# Altium project EPS_board.PrjPcb
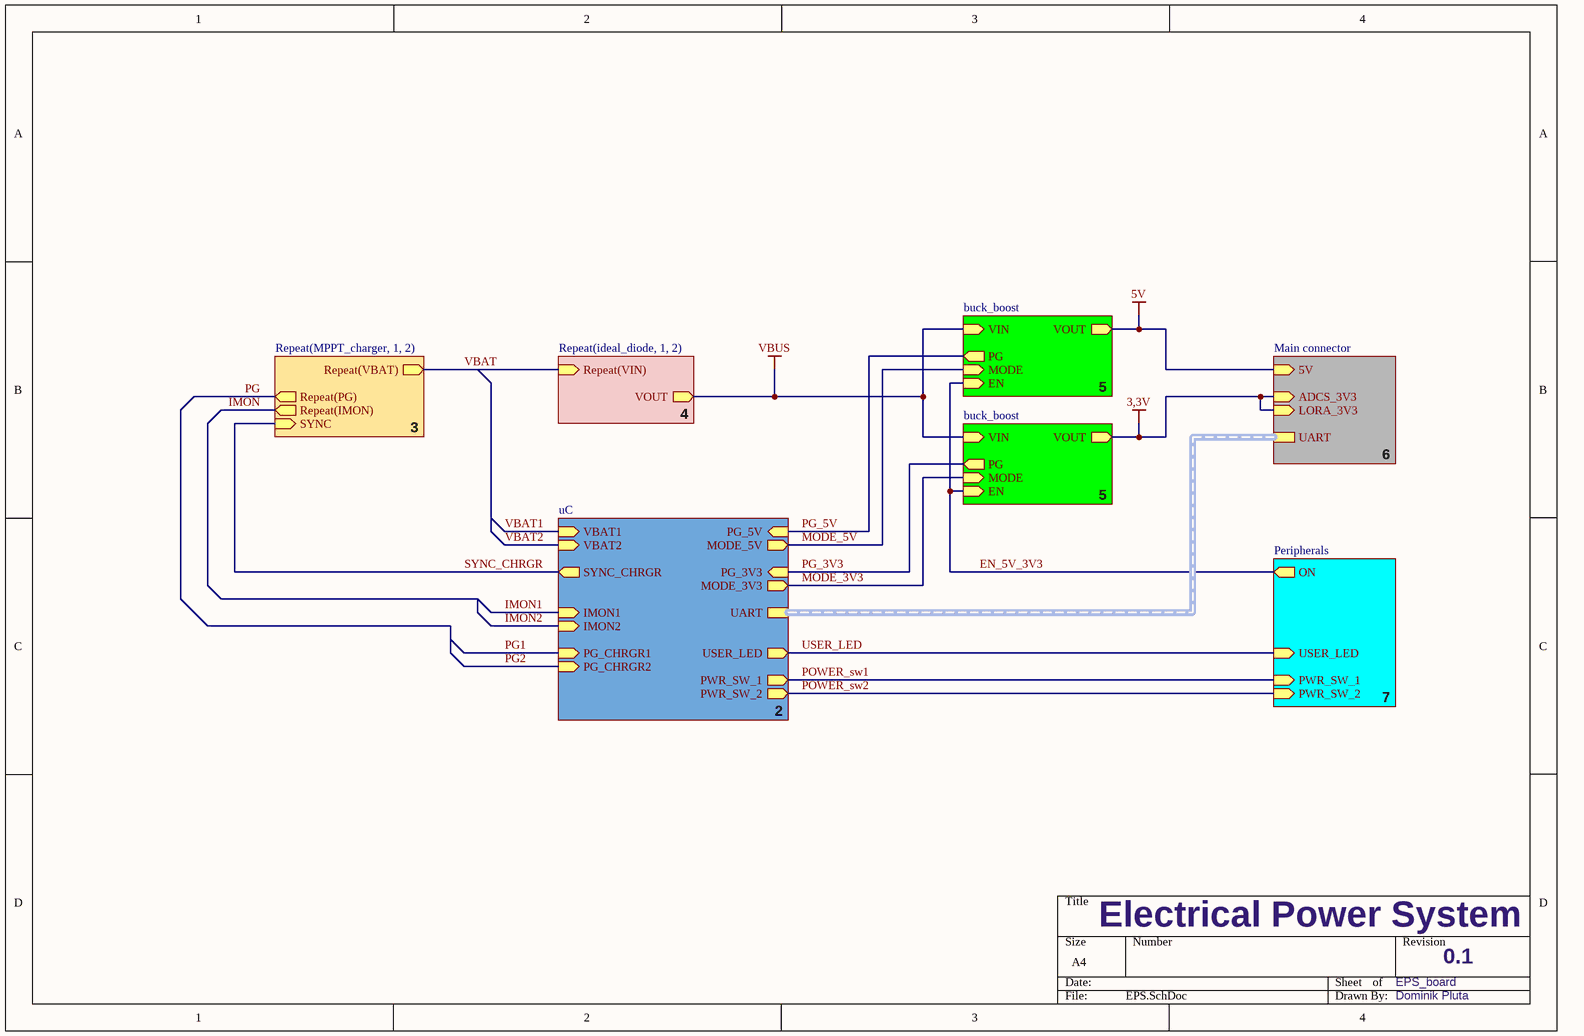
[diagram p0: EPS.SchDoc]
7 sheets, 124 parts. Net scope: hierarchical (ports join the sheet entries above them; power ports are global).
Board file: EPS.PcbDoc
Sheets:
  EPS.SchDoc
    uC = uC.SchDoc
    MPPT_charger1 = MPPT_charger.SchDoc
    MPPT_charger2 = MPPT_charger.SchDoc
    buck_boost = buck_boost.SchDoc
    buck_boost = buck_boost.SchDoc
    ideal_diode1 = ideal_diode.SchDoc
    ideal_diode2 = ideal_diode.SchDoc
    Main connector = main_connector.SchDoc
    Peripherals = peripherals.SchDoc

## Sheet EPS.SchDoc
size A4; SheetNumber: 1; SheetTotal: 7

### Sub-sheets
buck_boost = buck_boost.SchDoc: VIN (in), EN (in), MODE (in), VOUT (out), PG (out)
buck_boost = buck_boost.SchDoc: VIN (in), EN (in), MODE (in), VOUT (out), PG (out)
Main connector = main_connector.SchDoc: 5V (in), ADCS_3V3 (in), LORA_3V3 (in), UART (harness UART)
Peripherals = peripherals.SchDoc: ON (out), PWR_SW_1 (in), PWR_SW_2 (in), USER_LED (in)
Repeat(ideal_diode, 1, 2) = ideal_diode.SchDoc: VOUT (out), Repeat(VIN) (in)
Repeat(MPPT_charger, 1, 2) = MPPT_charger.SchDoc: Repeat(PG) (out), Repeat(IMON) (out), Repeat(VBAT) (out), SYNC (in)
uC = uC.SchDoc: VBAT1 (in), VBAT2 (in), USER_LED (out), MODE_5V (out), PG_5V (in), MODE_3V3 (out), PG_3V3 (in), IMON1 (in), PG_CHRGR1 (in), SYNC_CHRGR (out), IMON2 (in), PG_CHRGR2 (in), UART (harness UART), PWR_SW_1 (out), PWR_SW_2 (out)

### Nets
3,3V: sheet buck_boost/VOUT, sheet Main connector/ADCS_3V3, sheet Main connector/LORA_3V3
5V: sheet buck_boost/VOUT, sheet Main connector/5V
VBUS: sheet buck_boost/VIN, sheet buck_boost/VIN, sheet Repeat(ideal_diode, 1, 2)/VOUT
EN_5V_3V3: sheet buck_boost/EN, sheet buck_boost/EN, sheet Peripherals/ON
IMON: sheet Repeat(MPPT_charger, 1, 2)/Repeat(IMON)
MODE_3V3: sheet uC/MODE_3V3, sheet buck_boost/MODE
MODE_5V: sheet uC/MODE_5V, sheet buck_boost/MODE
PG: sheet Repeat(MPPT_charger, 1, 2)/Repeat(PG)
PG_3V3: sheet uC/PG_3V3, sheet buck_boost/PG
PG_5V: sheet uC/PG_5V, sheet buck_boost/PG
POWER_sw1: sheet uC/PWR_SW_1, sheet Peripherals/PWR_SW_1
POWER_sw2: sheet uC/PWR_SW_2, sheet Peripherals/PWR_SW_2
SYNC_CHRGR: sheet uC/SYNC_CHRGR, sheet Repeat(MPPT_charger, 1, 2)/SYNC
USER_LED: sheet uC/USER_LED, sheet Peripherals/USER_LED
VBAT: sheet Repeat(MPPT_charger, 1, 2)/Repeat(VBAT), sheet Repeat(ideal_diode, 1, 2)/Repeat(VIN)

### Buses and harness runs
harness sheet Main connector/UART = sheet uC/UART

### Notes on the sheet
- 3
- 4
- 5
- 6
- 2
- 7
- Electrical Power System
- EPS_board
- 0.1
- Dominik Pluta

## Sheet uC.SchDoc
size A3; SheetNumber: 2; SheetTotal: 7
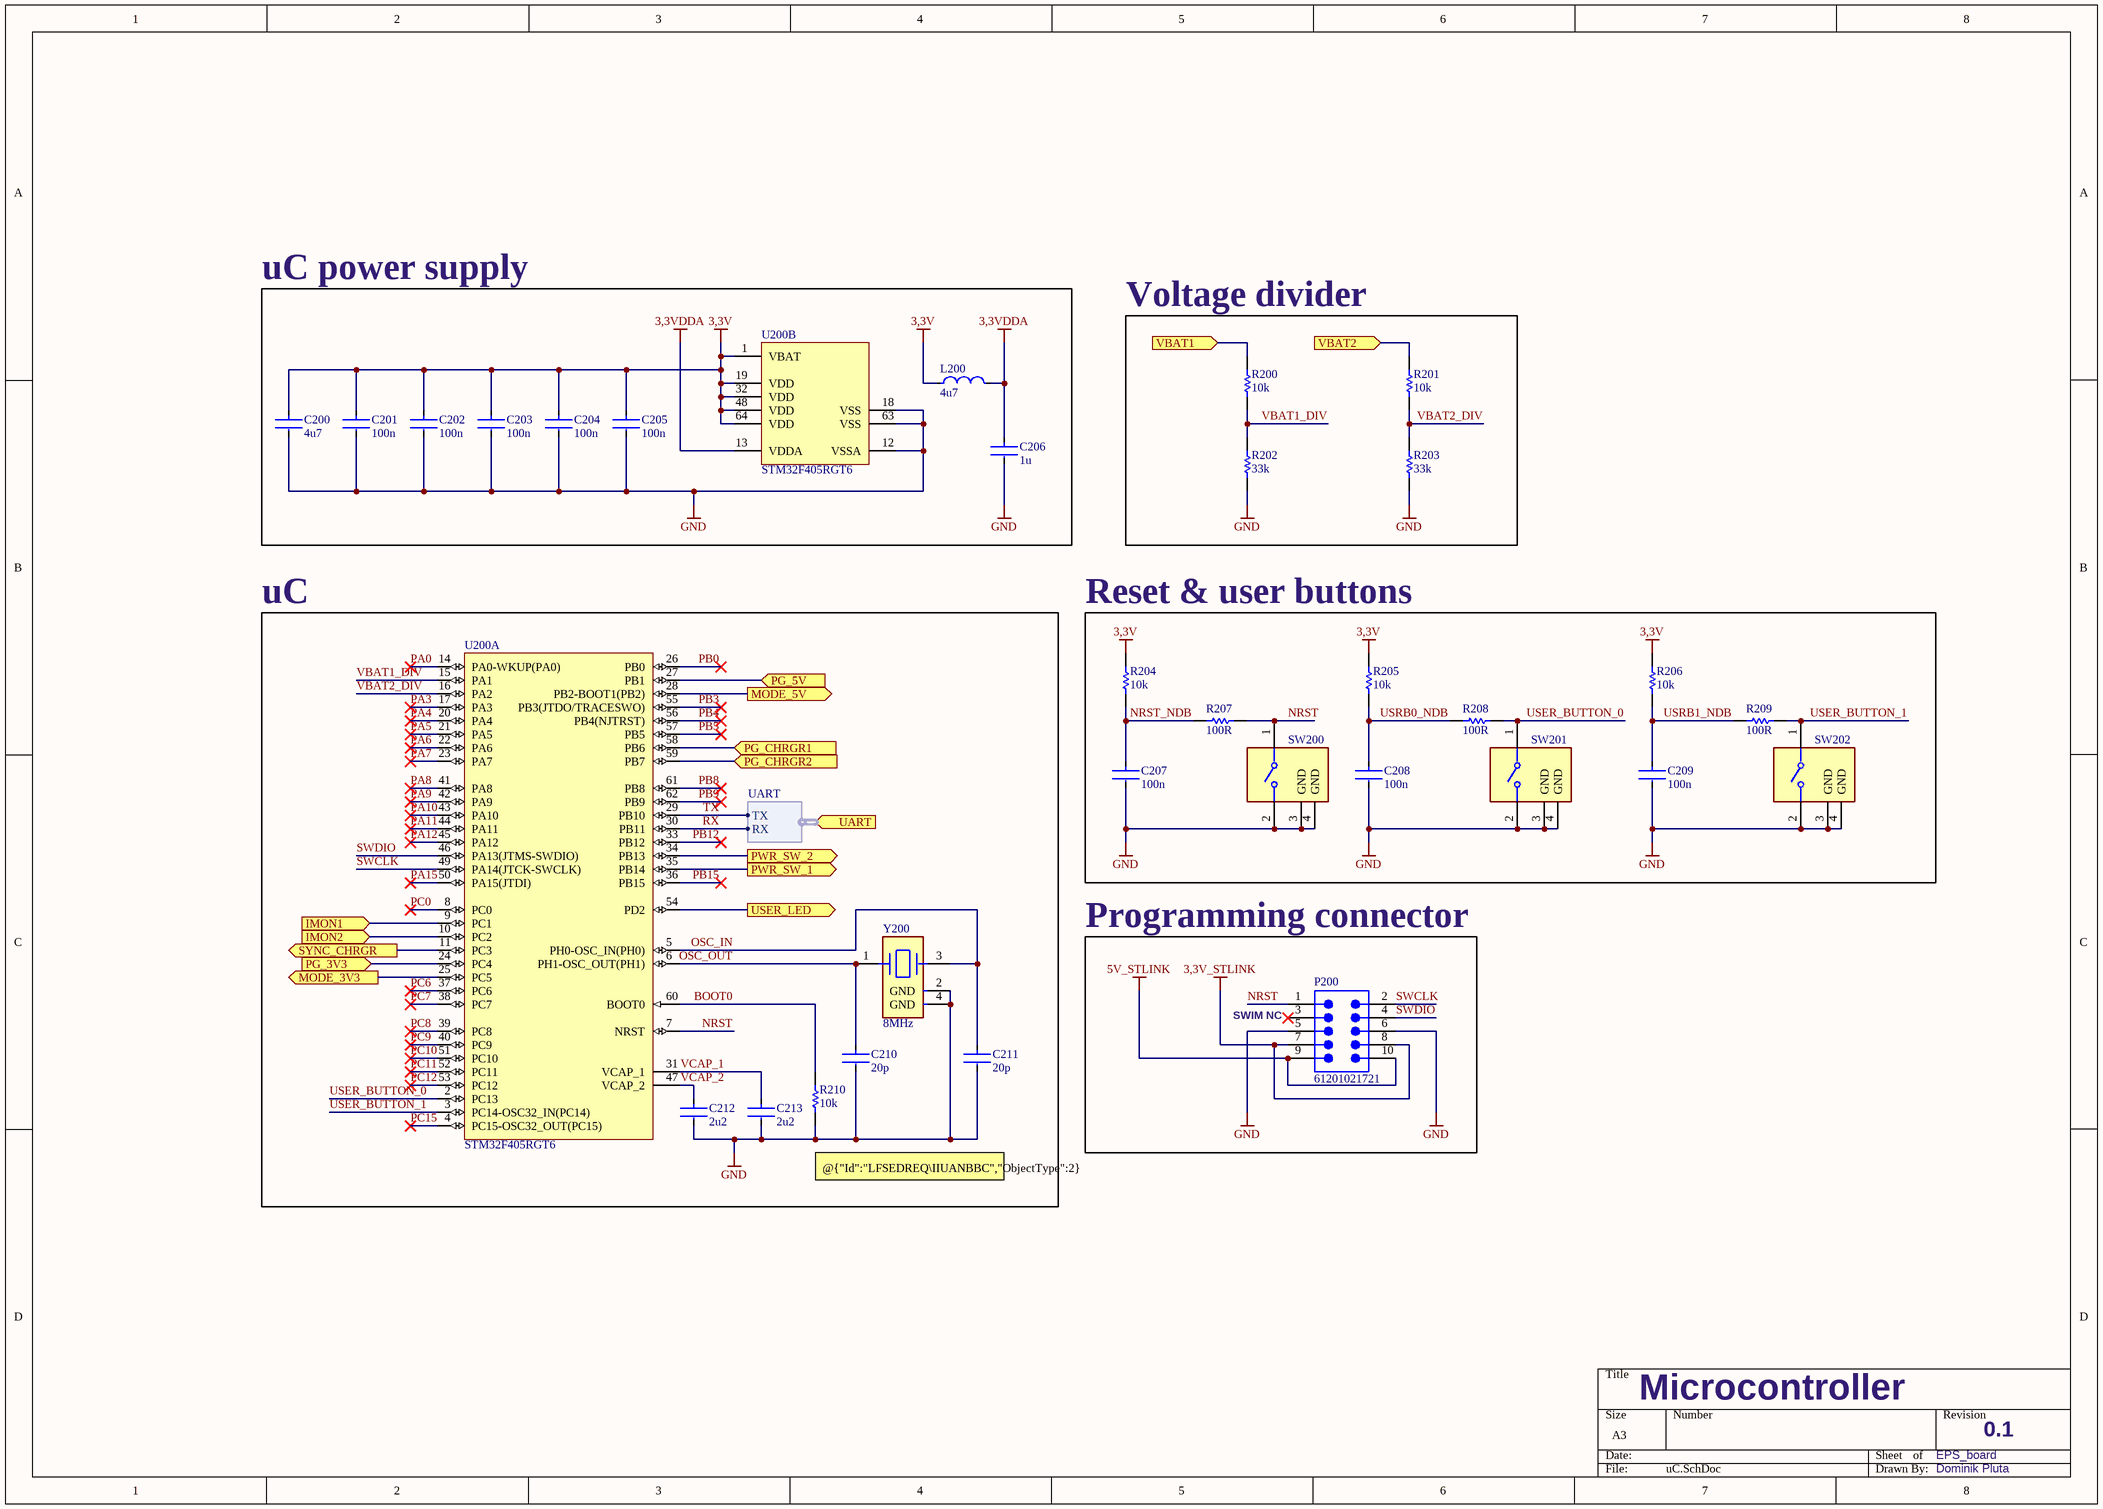
[diagram p1: uC.SchDoc]

### Parts
C200  4u7  [FP-C0603C-CF-MFG]
C201  100n  [FP-C0603C-CF-MFG]
C202  100n  [FP-C0603C-CF-MFG]
C203  100n  [FP-C0603C-CF-MFG]
C204  100n  [FP-C0603C-CF-MFG]
C205  100n  [FP-C0603C-CF-MFG]
C206  1u  [FP-C0603C-CF-MFG]
C207  100n  [FP-C0603C-CF-MFG]
C208  100n  [FP-C0603C-CF-MFG]
C209  100n  [FP-C0603C-CF-MFG]
C210  20p  [FP-C0603C-CF-MFG]
C211  20p  [FP-C0603C-CF-MFG]
C212  2u2  [FP-C0603C-CF-MFG]
C213  2u2  [FP-C0603C-CF-MFG]
L200  4u7  [FP-LQM21DN_00-MFG]
P200  61201021721  [61201021721]
R200  10k  [RESC0603(1608)_N]
R201  10k  [RESC0603(1608)_N]
R202  33k  [RESC0603(1608)_N]
R203  33k  [RESC0603(1608)_N]
R204  10k  [RESC0603(1608)_N]
R205  10k  [RESC0603(1608)_N]
R206  10k  [RESC0603(1608)_N]
R207  100R  [RESC0603(1608)_N]
R208  100R  [RESC0603(1608)_N]
R209  100R  [RESC0603(1608)_N]
R210  10k  [RESC0603(1608)_N]
SW200  B3F-3122  [FP-B3F-3122-MFG]  (value not drawn)
SW201  B3F-3122  [FP-B3F-3122-MFG]  (value not drawn)
SW202  B3F-3122  [FP-B3F-3122-MFG]  (value not drawn)
U200  STM32F405RGT6  [STM-LQFP64_M]  (parts A,B of 2)
Y200  8MHz  [FP-7M-MFG]

### Blocks framed on the sheet
uC power supply: C200-C206 L200 U200
Voltage divider: R200-R203
uC: C210-C213 R210 U200 Y200
Reset & user buttons: C207-C209 R204-R209 SW200-SW202
Programming connector: P200

### Ports
IMON1 (in, see EPS[2C]), IMON2 (in, see EPS[2C]), MODE_3V3 (out, see EPS[3C]), MODE_5V (out, see EPS[3C]), PG_3V3 (in, see EPS[3C]), PG_5V (in, see EPS[3C]), PG_CHRGR1 (in, see EPS[2C]), PG_CHRGR2 (in, see EPS[2C]), PWR_SW_1 (out, see EPS[3C], peripherals[2B]), PWR_SW_2 (out, see EPS[3C], peripherals[2C]), SYNC_CHRGR (out, see EPS[2C]), UART (in, harness UART, see EPS[3C], main_connector[1C]), USER_LED (out, see EPS[3C], peripherals[1B]), VBAT1 (in, see EPS[2C]), VBAT2 (in, see EPS[2C])

### Harnesses
UART: RX, TX

### Nets
3,3V: C200.1 C201.1 C202.1 C203.1 C204.1 C205.1 L200.1 R204.2 R205.2 R206.2 U200.1(VBAT) U200.19(VDD) U200.32(VDD) U200.48(VDD) U200.64(VDD)
3,3V_STLINK: P200.7 P200.8
3,3VDDA: C206.1 L200.2 U200.13(VDDA)
5V_STLINK: P200.9 P200.10
GND: C200.2 C201.2 C202.2 C203.2 C204.2 C205.2 C206.2 C207.2 C208.2 C209.2 C210.2 C211.2 C212.2 C213.2 P200.5 P200.6 R202.1 R203.1 R210.1 SW200.2 SW200.3(GND) SW200.4(GND) SW201.2 SW201.3(GND) SW201.4(GND) SW202.2 SW202.3(GND) SW202.4(GND) U200.12(VSSA) U200.18(VSS) U200.63(VSS) Y200.2(GND) Y200.4(GND)
BOOT0: R210.2 U200.60(BOOT0)
IMON1: U200.9(PC1) ; port IMON1
IMON2: U200.10(PC2) ; port IMON2
MODE_3V3: U200.25(PC5) ; port MODE_3V3
MODE_5V: U200.28(PB2-BOOT1(PB2)) ; port MODE_5V
NRST: P200.1 R207.1 SW200.1 U200.7(NRST)
NRST_NDB: C207.1 R204.1 R207.2
OSC_IN: C211.1 U200.5(PH0-OSC_IN(PH0)) Y200.3
OSC_OUT: C210.1 U200.6(PH1-OSC_OUT(PH1)) Y200.1
PA0: U200.14(PA0-WKUP(PA0))
PA3: U200.17(PA3)
PA4: U200.20(PA4)
PA5: U200.21(PA5)
PA6: U200.22(PA6)
PA7: U200.23(PA7)
PA8: U200.41(PA8)
PA9: U200.42(PA9)
PA10: U200.43(PA10)
PA11: U200.44(PA11)
PA12: U200.45(PA12)
PA15: U200.50(PA15(JTDI))
PB0: U200.26(PB0)
PB3: U200.55(PB3(JTDO/TRACESWO))
PB4: U200.56(PB4(NJTRST))
PB5: U200.57(PB5)
PB8: U200.61(PB8)
PB9: U200.62(PB9)
PB12: U200.33(PB12)
PB15: U200.36(PB15)
PC0: U200.8(PC0)
PC6: U200.37(PC6)
PC7: U200.38(PC7)
PC8: U200.39(PC8)
PC9: U200.40(PC9)
PC10: U200.51(PC10)
PC11: U200.52(PC11)
PC12: U200.53(PC12)
PC15: U200.4(PC15-OSC32_OUT(PC15))
PG: U200.58(PB6) ; port PG_CHRGR1
PG: U200.59(PB7) ; port PG_CHRGR2  [a separate net that carries the same name]
PG_3V3: U200.24(PC4) ; port PG_3V3
PG_5V: U200.27(PB1) ; port PG_5V
POWER_sw1: U200.35(PB14) ; port PWR_SW_1
POWER_sw2: U200.34(PB13) ; port PWR_SW_2
RX: U200.30(PB11) ; port UART.RX
SWCLK: P200.2 U200.49(PA14(JTCK-SWCLK))
SWDIO: P200.4 U200.46(PA13(JTMS-SWDIO))
SYNC_CHRGR: U200.11(PC3) ; port SYNC_CHRGR
TX: U200.29(PB10) ; port UART.TX
USER_BUTTON_0: R208.1 SW201.1 U200.2(PC13)
USER_BUTTON_1: R209.1 SW202.1 U200.3(PC14-OSC32_IN(PC14))
USER_LED: U200.54(PD2) ; port USER_LED
USRB0_NDB: C208.1 R205.1 R208.2
USRB1_NDB: C209.1 R206.1 R209.2
VBAT1: R200.2 ; port VBAT1
VBAT1_DIV: R200.1 R202.2 U200.15(PA1)
VBAT2: R201.2 ; port VBAT2
VBAT2_DIV: R201.1 R203.2 U200.16(PA2)
VCAP_1: C213.1 U200.31(VCAP_1)
VCAP_2: C212.1 U200.47(VCAP_2)

Not connected (* = marked no-connect by the designer): P200 3*

### Notes on the sheet
- (near P200) SWIM NC
- @{"Id":"LFSEDREQ\IIUANBBC","ObjectType":2} = @{"Id":"LFSEDREQ\BUITQFAR","ObjectType":2} = (CL - 4pF) * 2
- Microcontroller
- EPS_board
- 0.1
- Dominik Pluta

### Library data of the parts
C200 C206 = CMP-2006-03061-2: CAP CER 0.1UF 50V X7R 0603; Manufacturer: KEMET; Manufacturer Part Number: C0603C104K5RACTU; Tolerance: 0.1; Temperature Coefficient: 30ppm/°C; Material: Ceramic; Automotive Grade: Grade 1; Value: 0.10 μF; Temperature: -55°C to +125°C; RoHS: TRUE; Temperature Range High: +125°C; Lead Free: Yes; Octopart: https://octopart.com/c0603c104k5ractu-kemet-139244; Digikey Description: CAP CER 0.1UF 50V X7R 0603; Category: Cap; Package: C0603C-CF; ComponentLink2Description: Datasheet; Temperature Range Low: -55°C; Device Class L1: Passive Components; Voltage Rating: 50 V; Automotive: Yes; Device Class L3: Ceramic Capacitors; ComponentLink2URL: https://api.kemet.com/component-edge/download/datasheet/C0603C100J5GACAUTO.pdf; Capacitance: 0.10 μF; Device Class L2: Capacitors; Temperature Characteristic: X7R; Height: 0.87mm
C201-C205 = CMP-2006-03061-2: CAP 0.1 μF, X5R or X7R ceramic; Tolerance: 10; Capacitance: 0.10 μF; Material: Ceramic; Category: Cap; Package: 0603; ComponentLink2Description: Datasheet; Device Class L1: Passive Components; Device Class L3: Ceramic Capacitors; ComponentLink2URL: https://api.kemet.com/component-edge/download/datasheet/C0603C100J5GACAUTO.pdf; Device Class L2: Capacitors
C207-C209 = CMP-2006-03061-2: CAP 0.1 μF, ceramic; Tolerance: 10; Capacitance: 0.10 μF; Material: Ceramic; Category: Cap; Package: 0603; ComponentLink2Description: Datasheet; Device Class L1: Passive Components; Device Class L3: Ceramic Capacitors; ComponentLink2URL: https://api.kemet.com/component-edge/download/datasheet/C0603C100J5GACAUTO.pdf; Device Class L2: Capacitors
C210-C213 = CMP-2006-03061-2: CAP CER 50V X7R 0603; Manufacturer: KEMET; Manufacturer Part Number: C0603C104K5RACTU; Tolerance: 0.1; Temperature Coefficient: 30ppm/°C; Material: Ceramic; Automotive Grade: Grade 1; Value: 0.10 μF; Temperature: -55°C to +125°C; RoHS: TRUE; Temperature Range High: +125°C; Lead Free: Yes; Octopart: https://octopart.com/c0603c104k5ractu-kemet-139244; Digikey Description: CAP CER 0.1UF 50V X7R 0603; Category: Cap; Package: C0603C-CF; ComponentLink2Description: Datasheet; Temperature Range Low: -55°C; Device Class L1: Passive Components; Voltage Rating: 50 V; Automotive: Yes; Device Class L3: Ceramic Capacitors; ComponentLink2URL: https://api.kemet.com/component-edge/download/datasheet/C0603C100J5GACAUTO.pdf; Capacitance: 0.10 μF; Device Class L2: Capacitors; Temperature Characteristic: X7R; Height: 0.87mm
L200 = CMP-06042-016438-1: Multilayer Type Inductor for General Circuits, 0805 (2012), 0.22μH, 10%, 0.38Ω, 250mA; Shielding: Shielded; Self Resonant Frequency: 220MHz; Q Factor: 20; DC Resistance (DCR): 380mR; Inductance: 220nH; Core Material: Ferrite; Test Frequency: 25MHz; Min Operating Temperature: -40°C; RoHS Compliant: Yes; Inductance Tolerance: 10%; Width: 1.25mm; Current Rating: 250mA; Rated Current-Max: 250mA; Package Quantity: 4000; Lead Free: Lead Free; Termination: SMD/SMT; Military Standard: Not; Case Code (Metric): 2012; Radiation Hardening: No; Max Operating Temperature: 85°C; Max DC Current: 250mA; Mount: Surface Mount; Length: 2mm; Packaging: Tape and Reel; Height - Seated (Max): 0.041inch; Series: LQM21N; Case Code (Imperial): 0805; Case/Package: 0805; REACH SVHC: No SVHC; Depth: 1.45mm; Tolerance: 10%; DC Current: 250mA; Number of Pins: 2; Height: 0.85mm
P200 = CMP-1502-00021-2: NexarPartId: 8917787; Operating Supply Voltage: 250V; Number of Positions: 10; Contact Resistance: 20mΩ; Connector Type: Male Pin; Current Rating: 3A; Pitch: 2.54mm; Gender: Male; Insulation Resistance: 1GΩ; Insulation: Insulated; Max Operating Temperature: 105°C; Flammability Rating: UL94 V-0; Mount: Through Hole; Contact Material: Copper; Min Operating Temperature: -40°C; Length: 20.36mm; Number of Contacts: 10; Height: 8.85mm; Number of Rows: 2; Housing Material: PBT; Color: Black; Contact Gender: Male; Orientation: Right Angle; Contact Plating: Gold; Number of Pins: 10; Voltage Rating (DC): 250V; RoHS: Compliant; Insulation Material: PBT; REACH SVHC: Unknown; Row Spacing: 2.54mm; Voltage Rating: 250V; Width: 20.36mm; Lead Pitch: 2.54mm; Termination: Through Hole
R200 R204-R206 R210 = CMP-1012-00081-1: 10k 0.1W 5% 0603 SMD; Case-Metric: 1608; Value: 10000.00 Ohm; Case-EIA: 0603; Tolerance: 5 %; Technology: SMT; Power: 0.1 W
R201 = CMP-1012-00081-1: 10k 0.1W 5% 0603  SMD; Case-Metric: 1608; Value: 10000.00 Ohm; Case-EIA: 0603; Tolerance: 5 %; Technology: SMT; Power: 0.1 W
R202 R203 = CMP-1012-00081-1: 33k 0.1W 5% 0603 SMD; Case-Metric: 1608; Value: 33000.00 Ohm; Case-EIA: 0603; Tolerance: 5 %; Technology: SMT; Power: 0.1 W
R207-R209 = CMP-1012-00081-1: 100R 0.1W 5% 0603  SMD; Case-Metric: 1608; Value: 100.00 Ohm; Case-EIA: 0603; Tolerance: 5 %; Technology: SMT; Power: 0.1 W
SW200-SW202 = CMP-08834-000053-1: SWITCH TACTILE SPST-NO 0.05A 24V; Max Current Rating: 50mA; Actuator Type: Standard; Ratings: IP00; Number of Poles: 1; Mechanical Life: 300000Cycles; Illumination Type: Non-Illuminated; Switch Function: Off-Mom; Actuator Color: Grey; Contact Resistance: 100mR; Throw Configuration: SPST; Actuator Length: 1.6mm; Switch Travel: 0.25mm; Operating Force: 1.47N; Weight: 0.25g; Voltage Rating (DC): 24V; Contact Plating: Gold; RoHS Compliant: Yes; Contact Material: Gold; Radiation Hardening: No; Packaging: Bulk; Height: 7.4mm; Min Operating Temperature: -25°C; Electrical Life: 300000Cycles; Depth: 7.85mm; Max Voltage Rating (DC): 24V; Mount: Through Hole; Width: 6.25mm; Current Rating: 50mA; Lead Free: Lead Free; Max Operating Temperature: 70°C; Series: B3F; Contact Current Rating: 50mA; Package Quantity: 1000; Termination: PC Pins; Orientation: Right Angle; Length: 7.3mm
U200 = CMP-0243-00019-3: ARM Cortex-M4 32-bit MCU+FPU, 210 DMIPS, 1024 kB Flash, 192 kB Internal RAM, 51 I/Os, 64-pin LQFP, -40 to 85 degC, Tray; Manufacturer: STMicroelectronics; Supply Voltage(Vcc) min (V): 1.8; Supply Voltage(Vcc) max (V): 3.6; Internal RAM Size (kB): 192; I/Os (High Current): 51; D/A Converter: 2x12-bit; FLASH Size (Prog) (kB): 1024; Operating Frequency(F) (Processor speed) (MHz): 168; ComponentLink2Description: Datasheet; PackageVersion: Rev. 4, 06/2013; DatasheetVersion: Rev. 4; Core: ARM Cortex-M4; ComponentLink2URL: http://www.st.com/st-web-ui/static/active/en/resource/technical/document/datasheet/DM00037051.pdf; PackageReference: LQFP64; Packing: Tray; ComponentLink1Description: Manufacturer URL; ComponentLink3URL: http://www.st.com/st-web-ui/static/active/en/resource/technical/document/datasheet/DM00037051.pdf; ComponentLink3Description: Package Specification; Mounting Technology: Surface Mount; ComponentLink1URL: http://www.st.com/web/en/home.html; PackageDescription: 64-Pin Low Profile Quad Flat Package, 10 x 10 mm Body, 0.5 mm Pitch; PartNumber: STM32F405RGT6
Y200 = CMP-18717-000311-1: Crystal oscillator 8MHz; ESR (Equivalent Series Resistance): 100R; Frequency Stability: 10ppm; Load Capacitance: 10pF; Width: 0.098inch; Number of Pins: 4; Case/Package: SMD/SMT; REACH SVHC: No SVHC; Frequency: 8MHz; Mount: Surface Mount; Max Operating Temperature: 70°C; RoHS Compliant: Yes; Depth: 2.5mm; Length: 3.2mm; Termination: SMD/SMT; Frequency Tolerance: 10ppm; Min Operating Temperature: -20°C; Series: 7M; Packaging: Tape and Reel; Tolerance: 10ppm; Height: 0.031inch; Package Quantity: 3000

## Sheet MPPT_charger.SchDoc
size A4; SheetNumber: 3; SheetTotal: 7
Used 2 times, as channels MPPT_charger1, MPPT_charger2. Parts and nets are listed once, with the designators drawn on the sheet.
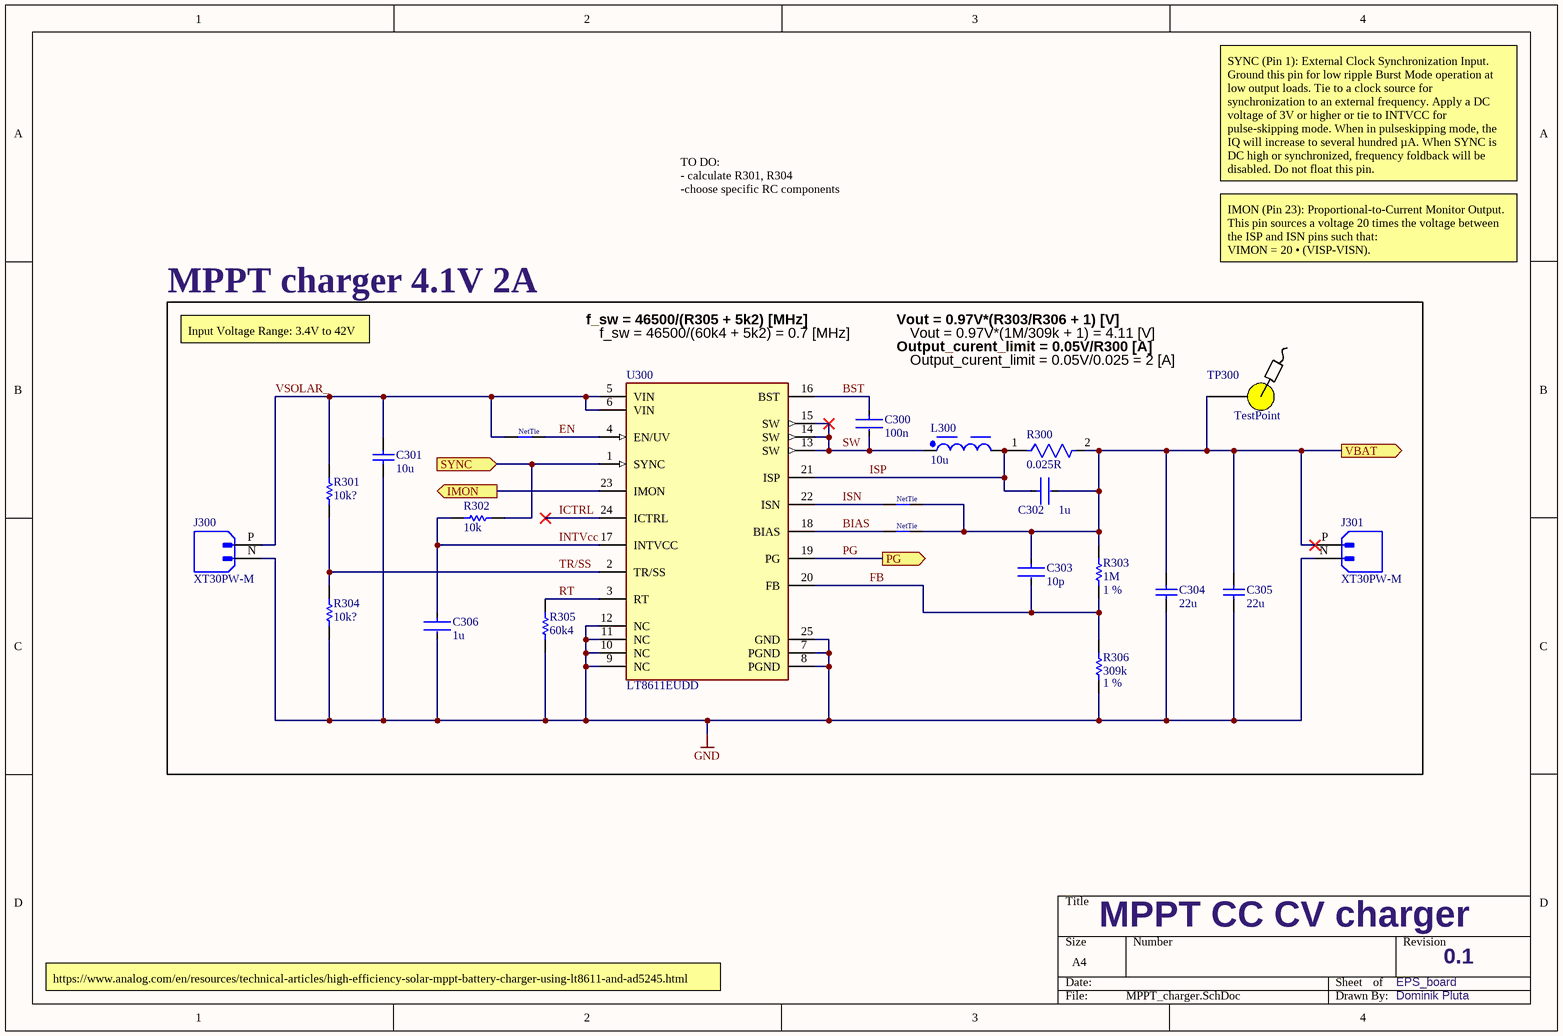
[diagram p2: MPPT_charger.SchDoc]

### Parts
C300  100n  [FP-C0603C-CF-MFG]
C301  10u  [KEMT-1206-2_M]
C302  1u  [FP-C0603C-CF-MFG]
C303  10p  [FP-C0603C-CF-MFG]
C304  22u  [KEMT-1206-2_M]
C305  22u  [KEMT-1206-2_M]
C306  1u  [FP-C0603C-CF-MFG]
J300  XT30PW-M  [AMASS_XT30PW-M]
J301  XT30PW-M  [AMASS_XT30PW-M]
L300  10u  [WE-MAPI_5030]
NT300  NetTie  [NetTie]  (net tie, no BOM)
NT301  NetTie  [NetTie]  (net tie, no BOM)
NT302  NetTie  [NetTie]  (net tie, no BOM)
R300  0.025R  [FP-CR0805-IPC_B]
R301  10k?  [RESC0603(1608)_N]
R302  10k  [RESC0603(1608)_N]
R303  1M  Tolerance: 1 %  [RESC0603(1608)_N]
R304  10k?  [RESC0603(1608)_N]
R305  60k4  [RESC0603(1608)_N]
R306  309k  Tolerance: 1 %  [RESC0603(1608)_N]
TP300  TestPoint  [Test-point]  (no BOM)
U300  LT8611EUDD  [FP-UDD-24-05-08-1833-IPC_B]

### Ports
IMON (out, see EPS[1B]), PG (out, see EPS[1B]), SYNC (in, see EPS[1B]), VBAT (out, see EPS[2B])

### Nets
GND: C301.1 C304.1 C305.1 C306.2 J300.N J301.N R304.1 R305.1 R306.1 U300.7(PGND) U300.8(PGND) U300.9(NC) U300.10(NC) U300.11(NC) U300.12(NC) U300.25(GND)
BIAS: NT302.1 U300.18(BIAS)
BST: C300.1 U300.16(BST)
EN: NT300.2 U300.4(EN/UV)
FB: C303.2 R303.1 R306.2 U300.20(FB)
ICTRL: U300.24(ICTRL)
IMON: U300.23(IMON) ; port IMON
INTVcc: C306.1 R302.2 U300.17(INTVCC)
ISN: NT301.1 U300.22(ISN)
ISP: C302.1 L300.2 R300.1 U300.21(ISP)
PG: U300.19(PG) ; port PG
RT: R305.2 U300.3(RT)
SW: C300.2 L300.1 U300.13(SW) U300.14(SW) U300.15(SW)
SYNC: R302.1 U300.1(SYNC) ; port SYNC
TR/SS: R301.1 R304.2 U300.2(TR/SS)
VBAT: C302.2 C303.1 C304.2 C305.2 J301.P NT301.2 NT302.2 R300.2 R303.2 TP300.1 ; port VBAT
VSOLAR_: C301.2 J300.P NT300.1 R301.2 U300.5(VIN) U300.6(VIN)

### Channels
MPPT_charger1: designators end in A; ports IMON=IMON1 PG=PG SYNC=SYNC_CHRGR VBAT=VBAT1
MPPT_charger2: designators end in B; ports IMON=IMON2 PG=PG SYNC=SYNC_CHRGR VBAT=VBAT2

### Notes on the sheet
- SYNC (Pin 1): External Clock Synchronization Input. Ground this pin for low ripple Burst Mode operation at low output loads. Tie to a clock source for synchronization to an external frequency. Apply a DC voltage of 3V or higher or tie to INTVCC for pulse-skipping mode. When in pulseskipping mode, the IQ will increase to several hundred µA. When SYNC is DC high or synchronized, frequency foldback will be disabled. Do not float this pin.
- TO DO:
  - calculate R301, R304
  -choose specific RC components
- MPPT charger 4.1V 2A
- IMON (Pin 23): Proportional-to-Current Monitor Output.
  This pin sources a voltage 20 times the voltage between the ISP and ISN pins such that:
  VIMON = 20 • (VISP-VISN).
- Input Voltage Range: 3.4V to 42V
- f_sw = 46500/(R305 + 5k2) [MHz]
- f_sw = 46500/(60k4 + 5k2) = 0.7 [MHz]
- Vout = 0.97V*(R303/R306 + 1) [V]
- Output_curent_limit = 0.05V/R300 [A]
- Vout = 0.97V*(1M/309k + 1) = 4.11 [V]
- Output_curent_limit = 0.05V/0.025 = 2 [A]
- https://www.analog.com/en/resources/technical-articles/high-efficiency-solar-mppt-battery-charger-using-lt8611-and-ad5245.html
- MPPT CC CV charger
- EPS_board
- 0.1
- Dominik Pluta

### Library data of the parts
C300 C302 C303 = CMP-2006-03061-2: as C210 on sheet uC; Temperature: -55°C to +125°C; RoHS: TRUE; Temperature Range High: +125°C; Lead Free: Yes; Octopart: https://octopart.com/c0603c104k5ractu-kemet-139244; Digikey Description: CAP CER 0.1UF 50V X7R 0603; Category: Cap; Package: C0603C-CF; ComponentLink2Description: Datasheet; Temperature Range Low: -55°C; Device Class L1: Passive Components; Voltage Rating: 50 V; Automotive: Yes; Device Class L3: Ceramic Capacitors; ComponentLink2URL: https://api.kemet.com/component-edge/download/datasheet/C0603C100J5GACAUTO.pdf; Capacitance: 0.10 μF; Device Class L2: Capacitors; Temperature Characteristic: X7R; Height: 0.87mm
C301 C304 C305 = CMP-1037-04202-2: CAP, Ceramic, 0.1 uF, +/- 10%, 50 V, -55 to 125 degC, 1206 (3216 Metric), RoHS, Tape and Reel; Manufacturer: Kemet; Voltage Rating: 50V; Capacitance: 0.1µF; Product Range: KEMET-CSeries; SVHC: ToBeAdvised; Dielectric Characteristic: X7R; Capacitor Case Style: 1206[3216Metric]; Package Reference: 1206-2; Package Description: 2-Leads SMD, Body 3.2 x 1.6 mm; Packaging: Tape&Reel; Operating Temperature Max: 125degC; Capacitance Tolerance: ±10%; Datasheet URL: https://datasheet.ciiva.com/6125/1725438-6125494.pdf; Manufacturer URL: http://www.kemet.com/; Operating Temperature Min: -55degC; Datasheet Version: Jul-13
C306 = CMP-2006-03061-2: CAP CER 50V X7R 0603 / LOW ESR!; Manufacturer: KEMET; Manufacturer Part Number: C0603C104K5RACTU; Tolerance: 0.1; Temperature Coefficient: 30ppm/°C; Material: Ceramic; Automotive Grade: Grade 1; Value: 0.10 μF; Temperature: -55°C to +125°C; RoHS: TRUE; Temperature Range High: +125°C; Lead Free: Yes; Octopart: https://octopart.com/c0603c104k5ractu-kemet-139244; Digikey Description: CAP CER 0.1UF 50V X7R 0603; Category: Cap; Package: C0603C-CF; ComponentLink2Description: Datasheet; Temperature Range Low: -55°C; Device Class L1: Passive Components; Voltage Rating: 50 V; Automotive: Yes; Device Class L3: Ceramic Capacitors; ComponentLink2URL: https://api.kemet.com/component-edge/download/datasheet/C0603C100J5GACAUTO.pdf; Capacitance: 0.10 μF; Device Class L2: Capacitors; Temperature Characteristic: X7R; Height: 0.87mm
J300 J301 = XT30PW-M: Socket; DC supply; XT30; male; PIN: 2; on PCBs; THT; Colour: yellow; MF: AMASS; SnapEDA_Link: https://www.snapeda.com/parts/XT30PW-M/AMASS/view-part/?ref=snap; Package: None; Value: *; MP: XT30PW-M; Check_prices: https://www.snapeda.com/parts/XT30PW-M/AMASS/view-part/?ref=eda
L300 = CMP-03913-130924348-2: 74438367100 Power Inductor, 10Uh, Shielded, 4.8A Rohs Compliant: Yes; Current Rating: 3.3A; Inductance: 10µH; DC Resistance (DCR): 61mΩ; RoHS: Compliant; Ambient Temperature Range Low: -40°C; Min Operating Temperature: -40°C; Ambient Temperature Range High: 85°C; Length: 5.4mm; Max Operating Temperature: 125°C; Height: 3.1mm; NexarPartId: 130924348; Width: 5.4mm
NT300-NT302 = NetTie: Net tie
R300 = CMP-07231-005482-1: Thick Film Chip Resistors 0805 0.025Ω 0.125W 1% 100ppm/°C; Max Power Dissipation: 125mW; Voltage Rating: 150V; Resistance: 1kR; Package Quantity: 1; Contact Plating: Tin; Length: 2mm; Number of Terminations: 2; Max Operating Temperature: 155°C; Depth: 1.25mm; REACH SVHC: No SVHC; Case Code (Imperial): 0805; Termination: SMD/SMT; Min Operating Temperature: -55°C; Case Code (Metric): 2012; Width: 1.25mm; Packaging: Tape and Reel; Case/Package: 0805; Height: 0.5mm; Radiation Hardening: No; Thickness: 508um; Temperature Coefficient: 100ppm/°C; Mount: Surface Mount; Features: Moisture Resistant; Voltage Rating (DC): 150V; Composition: Thick Film; Power Rating: 125mW; Number of Pins: 2; Tolerance: 1%
R301 R304 R305 = CMP-1012-00081-1: 2K 0.1W 5% 0603 (1608 Metric)  SMD; Case-Metric: 1608; Value: 2000.00 Ohm; Case-EIA: 0603; Tolerance: 5 %; Technology: SMT; Power: 0.1 W
R302 = CMP-1012-00081-1: 10K 0.1W 5% 0603 (1608 Metric)  SMD; Case-Metric: 1608; Value: 2000.00 Ohm; Case-EIA: 0603; Tolerance: 5 %; Technology: SMT; Power: 0.1 W
R303 = CMP-1012-00081-1: 1M 0.1W 1% 0603 SMD; Case-Metric: 1608; Value: 1000000.00 Ohm; Case-EIA: 0603; Technology: SMT; Power: 0.1 W
R306 = CMP-1012-00081-1: 309k 0.1W 1% 0603 SMD; Case-Metric: 1608; Value: 309000.00 Ohm; Case-EIA: 0603; Technology: SMT; Power: 0.1 W
TP300 = Test-point: SMD test point
U300 = CMP-0491-02169-2: IC REG BUCK ADJ 2.5A 24QFN; Synchronous Rectifier: Yes; Number of Outputs: 1; Output Type: Adjustable; Switching Frequency: 2MHz; Efficiency: 96%; Output Voltage: 40V; Max Operating Temperature: 125°C; Output Current: 2.5A; RoHS Compliant: Yes; Case/Package: QFN; Package Quantity: 2500; Lead Free: Lead Free; Series: -; Number of Pins: 24; Min Operating Temperature: -40°C; Packaging: Tape and Reel

## Sheet buck_boost.SchDoc
size A4; SheetNumber: 5; SheetTotal: 7
Used 2 times, as channels buck_boost, buck_boost. Parts and nets are listed once, with the designators drawn on the sheet.
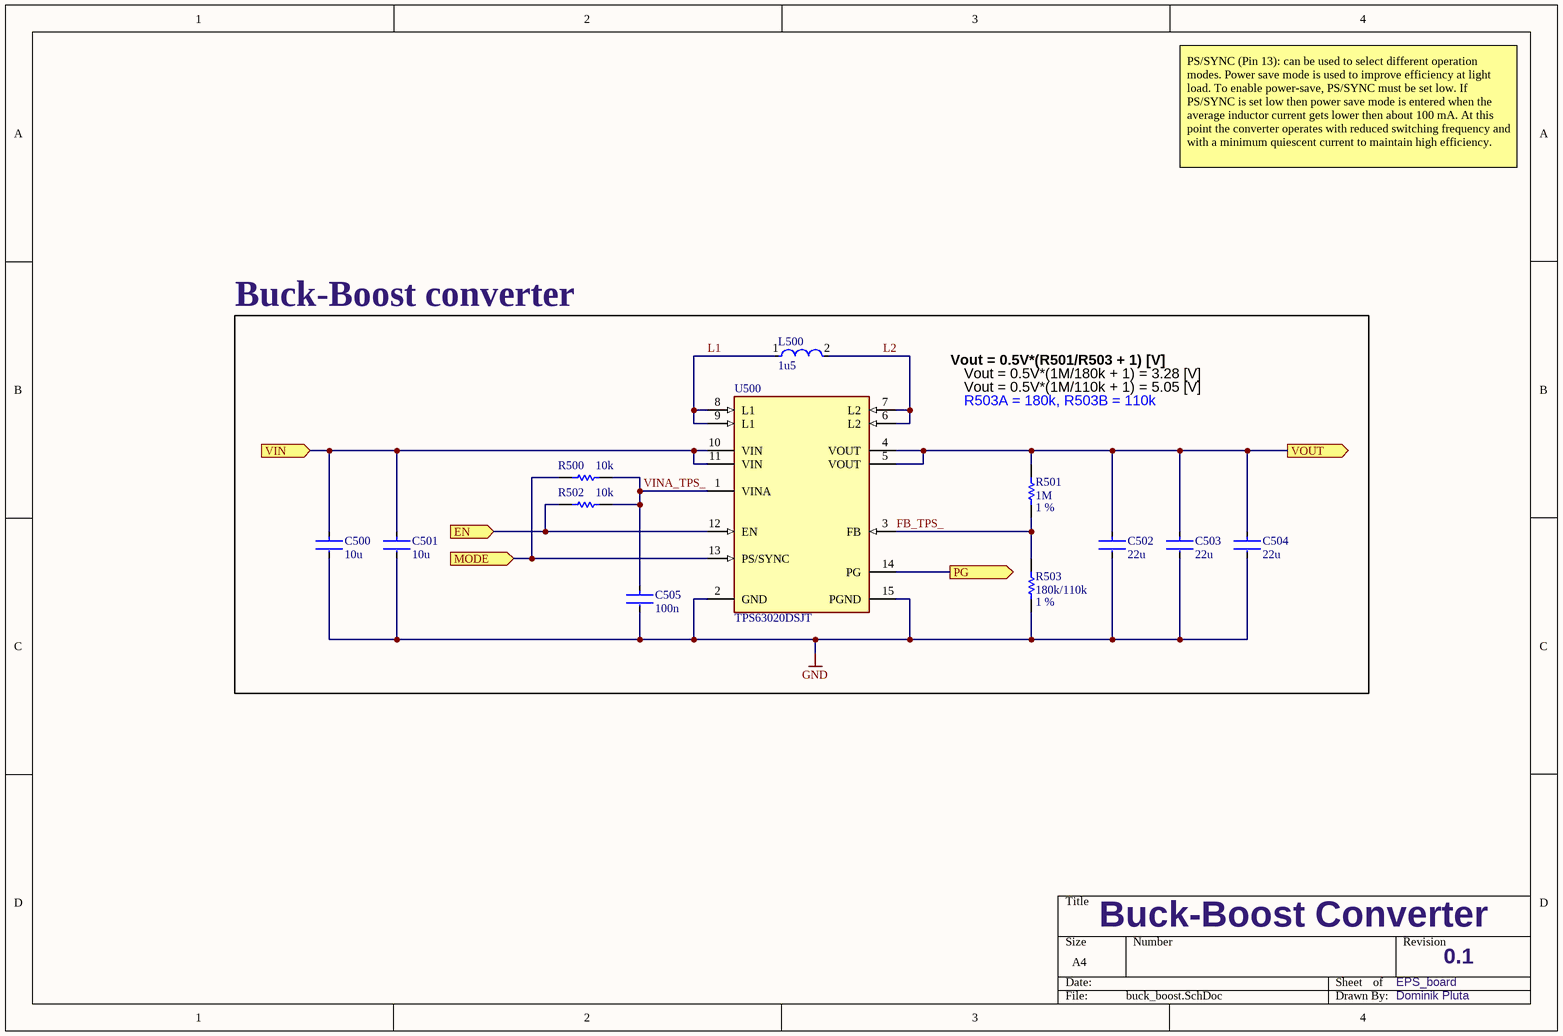
[diagram p3: buck_boost.SchDoc]

### Parts
C500  10u  [FP-C0603C-CF-MFG]
C501  10u  [FP-C0603C-CF-MFG]
C502  22u  [FP-C0603C-CF-MFG]
C503  22u  [FP-C0603C-CF-MFG]
C504  22u  [FP-C0603C-CF-MFG]
C505  100n  [FP-C0603C-CF-MFG]
L500  1u5  [FP-IHLP-1616BZ-FP_1_8545x-MFG]
R500  10k  [RESC0603(1608)_N]
R501  1M  Tolerance: 1 %  [RESC0603(1608)_N]
R502  10k  [RESC0603(1608)_N]
R503  180k/110k  Tolerance: 1 %  [RESC0603(1608)_N]
U500  TPS63020DSJT  [FP-DSJ0014A-MFG]

### Ports
EN (in, see EPS[3B]), MODE (in, see EPS[3B]), PG (out, see EPS[3B]), VIN (in, see EPS[3B]), VOUT (out, see EPS[3B])

### Nets
GND: C500.2 C501.2 C502.2 C503.2 C504.2 C505.2 R503.1 U500.2(GND) U500.15(PGND)
EN: R502.2 U500.12(EN) ; port EN
FB_TPS_: R501.1 R503.2 U500.3(FB)
L1: L500.1 U500.8(L1) U500.9(L1)
L2: L500.2 U500.6(L2) U500.7(L2)
MODE: R500.2 U500.13(PS/SYNC) ; port MODE
PG: U500.14(PG) ; port PG
VIN: C500.1 C501.1 U500.10(VIN) U500.11(VIN) ; port VIN
VINA_TPS_: C505.1 R500.1 R502.1 U500.1(VINA)
VOUT: C502.1 C503.1 C504.1 R501.2 U500.4(VOUT) U500.5(VOUT) ; port VOUT

### Channels
buck_boost: designators end in A; ports EN=EN_5V_3V3 MODE=MODE_5V PG=PG_5V VIN=VBUS VOUT=5V
buck_boost: designators end in B; ports EN=EN_5V_3V3 MODE=MODE_3V3 PG=PG_3V3 VIN=VBUS VOUT=3,3V

### Notes on the sheet
- PS/SYNC (Pin 13): can be used to select different operation modes. Power save mode is used to improve efficiency at light load. To enable power-save, PS/SYNC must be set low. If PS/SYNC is set low then power save mode is entered when the average inductor current gets lower then about 100 mA. At this point the converter operates with reduced switching frequency and with a minimum quiescent current to maintain high efficiency.
- Buck-Boost converter
- Vout = 0.5V*(R501/R503 + 1) [V]
- Vout = 0.5V*(1M/180k + 1) = 3.28 [V]
- Vout = 0.5V*(1M/110k + 1) = 5.05 [V]
- R503A = 180k, R503B = 110k
- Buck-Boost Converter
- EPS_board
- 0.1
- Dominik Pluta

### Library data of the parts
C500 C501 = CMP-2006-03061-2: CAP 10 μF 20% 6.3V, 0603, X5R ceramic, eg: GRM188R60J106ME84D; Manufacturer: MURATA; Voltage Rating: 6V3; Capacitance: 10 μF; Tolerance: 20%; Temperature: -55°C to +85°C; RoHS: TRUE; Material: Ceramic; Category: Cap; Package: 0603; ComponentLink2Description: Datasheet; Device Class L1: Passive Components; Device Class L3: Ceramic Capacitors; ComponentLink2URL: https://api.kemet.com/component-edge/download/datasheet/C0603C100J5GACAUTO.pdf; Device Class L2: Capacitors; Manufacturer-part-number: GRM188R60J106ME84D; Temperature Characteristic: X5R
C502-C504 = CMP-2006-03061-2: CAP 22 μF 20% 6.3V, 0603, X5R ceramic, eg: GRM188R60J226MEAOL; Manufacturer: MURATA; Voltage Rating: 6V3; Capacitance: 22 μF; Tolerance: 20%; Temperature: -55°C to +85°C; RoHS: TRUE; Material: Ceramic; Category: Cap; Package: 0603; ComponentLink2Description: Datasheet; Device Class L1: Passive Components; Device Class L3: Ceramic Capacitors; ComponentLink2URL: https://api.kemet.com/component-edge/download/datasheet/C0603C100J5GACAUTO.pdf; Device Class L2: Capacitors; Manufacturer-part-number: GRM188R60J226MEAOL; Temperature Characteristic: X5R
C505 = CMP-2006-03061-2: as C201 on sheet uC; Material: Ceramic; Category: Cap; Package: 0603; ComponentLink2Description: Datasheet; Device Class L1: Passive Components; Device Class L3: Ceramic Capacitors; ComponentLink2URL: https://api.kemet.com/component-edge/download/datasheet/C0603C100J5GACAUTO.pdf; Device Class L2: Capacitors
L500 = CMP-02424-000354-1: XFL4020-152ML / 1.5uH 4.6A 15.8mΩ 20%; Test Frequency: 1MHz; DC Resistance (DCR): 15.8mR; Self Resonant Frequency: 59MHz; Shielding: Shielded; Max DC Current: 9.1 A; Core Material: Composite; Inductance Tolerance: 20%; Tolerance: 20%; Termination: SMD/SMT; Max Operating Temperature: 125°C; Saturation Current: 4.6A; Inductance: 1.5uH; Mount: Surface Mount; Case Code (Metric): 4040; Min Operating Temperature: -40°C; Manufacturer Part Number: XFL4020-152ML
R500 R502 = CMP-1012-00081-1: as R200 on sheet uC; Tolerance: 5 %; Technology: SMT; Power: 0.1 W
R501 = CMP-1012-00081-1: 1M 0.1W 1% 0603  SMD; Case-Metric: 1608; Value: 1000000.00 Ohm; Case-EIA: 0603; Technology: SMT; Power: 0.1 W
R503 = CMP-1012-00081-1: 180k/110k 0.1W 1% 0603 (1608 Metric)  SMD; Case-Metric: 1608; Value: 18000/110000 Ohm; Case-EIA: 0603; Technology: SMT; Power: 0.1 W
U500 = CMP-2000-07282-2: IC REG BCK BST ADJ 3.5A 14VSON; Manufacturer: Texas Instruments; Switching Frequency: 2400kHz; Output Voltage: 1.2-5.5V; Nominal Supply Current: 25uA; Standoff Height: 0mm; Switching Topology: Buck-Boost; Min Supply Voltage: 1.8V; Output Type: AdjustableProgrammable; Max Junction Temp: +125°C; Number Of Outputs: 1; Output Current: 3A; Max Supply Voltage: 5.5V; ComponentLink2URL: https://www.ti.com/lit/ds/symlink/tps63020.pdf; Ambient Temperature Range High: +85°C; Digikey Description: IC REG BCK BST ADJ 3.5A 14VSON; Ambient Temperature Range Low: -40°C; Manufacturer Part Number: TPS63020DSJT; Automotive: No; Package: DSJ0014A; Category: IC; Temperature Range High: +85°C; Temperature: -40°C to +85°C; Octopart: https://octopart.com/tps63020dsjt-texas+instruments-12976119; Temperature Range Low: -40°C; Device Class L3: Voltage Regulators - Switching; Device Class L2: Power Management ICs; RoHS: TRUE; Lead Free: Yes; Height: 1mm; Device Class L1: Integrated Circuits (ICs); Mouser Description: Voltage Regulators - Switching Regulators 93% Eff Buck-Boost Converter; ComponentLink2Description: Datasheet

## Sheet ideal_diode.SchDoc
size A4; SheetNumber: 4; SheetTotal: 7
Used 2 times, as channels ideal_diode1, ideal_diode2. Parts and nets are listed once, with the designators drawn on the sheet.
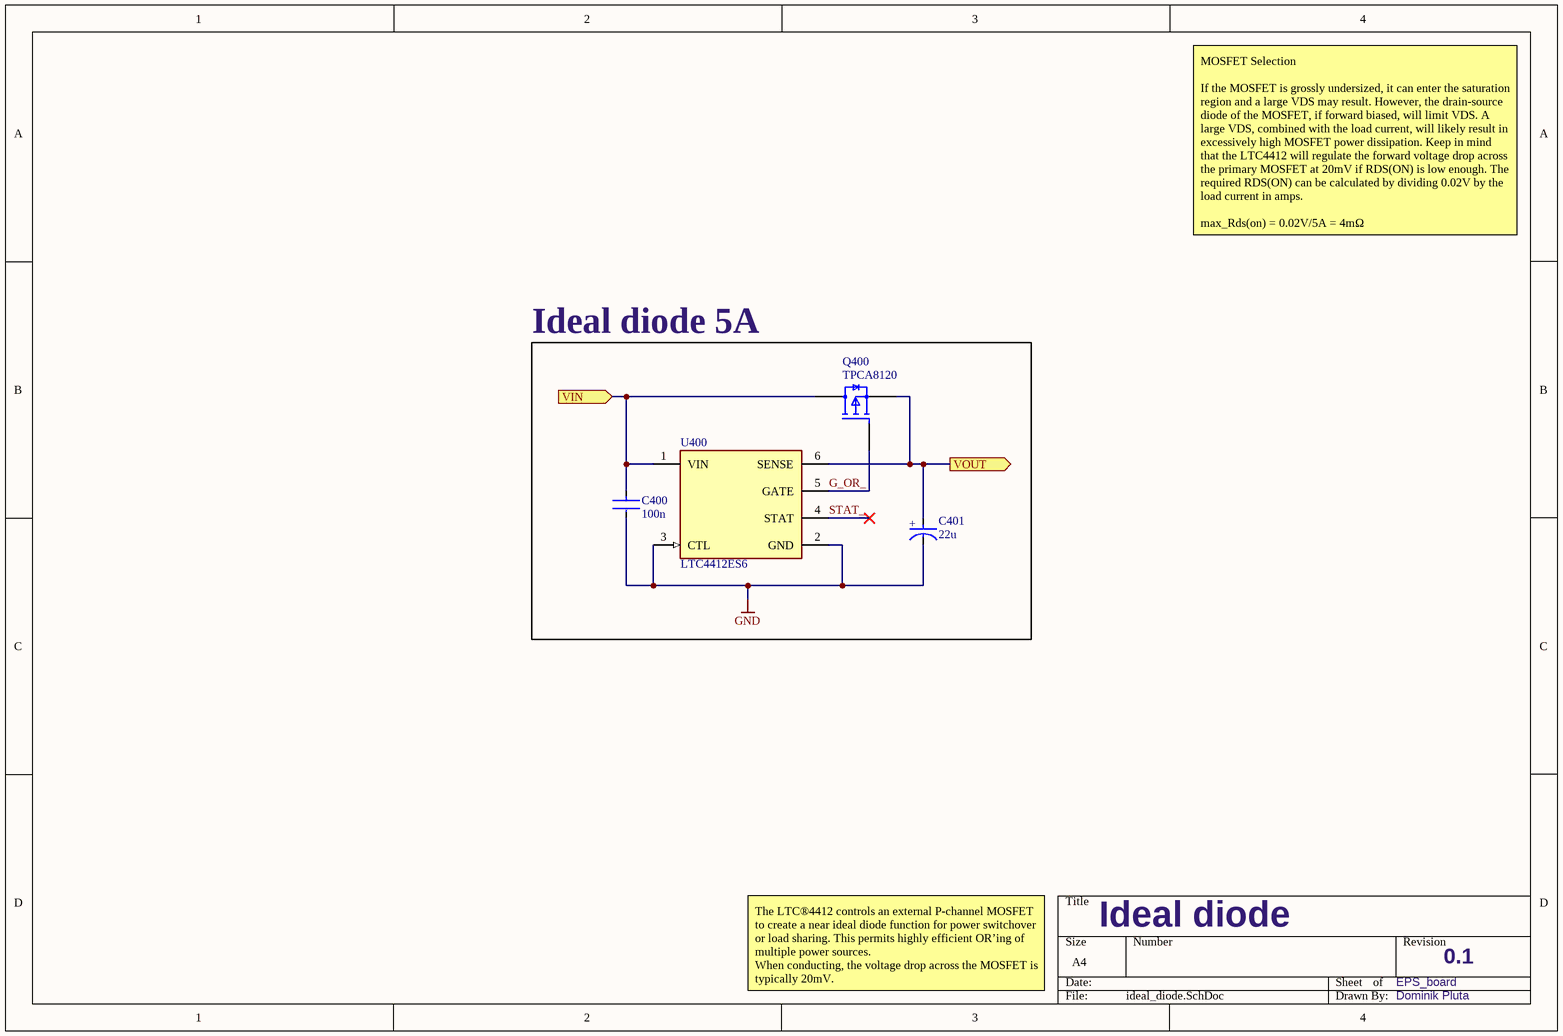
[diagram p4: ideal_diode.SchDoc]

### Parts
C400  100n  [FP-C0603C-CF-MFG]
C401  22u  [FP-T491B107K006AT-MFG]
Q400  TPCA8120  [TPCA8120]
U400  LTC4412ES6  [FP-S6-6-05-08-1636-IPC_C]

### Blocks framed on the sheet
Ideal diode 5A: C400 C401 Q400 U400

### Ports
VIN (in, see EPS[2B]), VOUT (out, see EPS[2B])

### Nets
GND: C400.2 C401.1(C) U400.2(GND) U400.3(CTL)
G_OR_: Q400.2(G) U400.5(GATE)
STAT_: U400.4(STAT)
VIN: C400.1 Q400.3(D) U400.1(VIN) ; port VIN
VOUT: C401.2(A) Q400.1(S) U400.6(SENSE) ; port VOUT

### Channels
ideal_diode1: designators end in A; ports VIN=VBAT1 VOUT=VBUS
ideal_diode2: designators end in B; ports VIN=VBAT2 VOUT=VBUS

### Notes on the sheet
- MOSFET Selection
  If the MOSFET is grossly undersized, it can enter the saturation region and a large VDS may result. However, the drain-source diode of the MOSFET, if forward biased, will limit VDS. A large VDS, combined with the load current, will likely result in excessively high MOSFET power dissipation. Keep in mind that the LTC4412 will regulate the forward voltage drop across the primary MOSFET at 20mV if RDS(ON) is low enough. The required RDS(ON) can be calculated by dividing 0.02V by the load current in amps.
  max_Rds(on) = 0.02V/5A = 4mΩ
- The LTC®4412 controls an external P-channel MOSFET to create a near ideal diode function for power switchover or load sharing. This permits highly efficient OR’ing of multiple power sources.
  When conducting, the voltage drop across the MOSFET is typically 20mV.
- Ideal diode
- EPS_board
- 0.1
- Dominik Pluta
- (in symbol CMP-03017-000031-1) +

### Library data of the parts
C400 = CMP-2006-03061-2: as C201 on sheet uC; Material: Ceramic; Category: Cap; Package: 0603; ComponentLink2Description: Datasheet; Device Class L1: Passive Components; Device Class L3: Ceramic Capacitors; ComponentLink2URL: https://api.kemet.com/component-edge/download/datasheet/C0603C100J5GACAUTO.pdf; Device Class L2: Capacitors
C401 = CMP-03017-000031-1: CAP TANT 22UF 10% 6.3V 1411; ESR (Equivalent Series Resistance): 3R; Dielectric Material: Tantalum; Leakage Current: 6.3uA; Dissipation Factor: 15%; Polarity: Polar; Case Code (Imperial): 1411; Voltage Rating: 6.3V; Length: 3.5mm; Depth: 2.8mm; Case/Package: 1411; Height - Seated (Max): 0.083inch; Termination: SMD/SMT; REACH SVHC: No SVHC; Width: 2.8mm; Mount: Surface Mount; Number of Pins: 2; Case Code (Metric): 3528; Tolerance: 10%; Lead Free: Lead Free; Capacitance: 22uF; Features: General Purpose; Height: 1.9mm
Q400 = TPCA8120: MOSFET P-CH 30V 45A SOP Advance; pin to pad: 1>1+2+3 2>4 3>5+6+7+8+9; Drain-source voltage (max): -30V; Gate-source voltage (max): -25/+20V; Drain current (DC): -45A; Gate threshold voltage (max): -2V; RDS(ON) @ VGS = -10: 2.4 mΩ
U400 = CMP-0479-00425-2: IC OR CTRLR SRC SELECT TSOT23-6; Min Supply Voltage: 2.5V; Max Supply Voltage: 28V; Turn-On Delay Time: 110us; Number of Channels: 1; Lead Free: Lead Free; Length: 2.9mm; Radiation Hardening: No; RoHS Compliant: Yes; Package Quantity: 1; Min Operating Temperature: -40°C; Series: PowerPath™; Packaging: Tape and Reel; Width: 1.75mm; Height: 0.9mm; Number of Pins: 6; Max Operating Temperature: 85°C; Number of Outputs: 1; Case/Package: TSOT; REACH SVHC: No SVHC

## Sheet main_connector.SchDoc
size A4; SheetNumber: 6; SheetTotal: 7
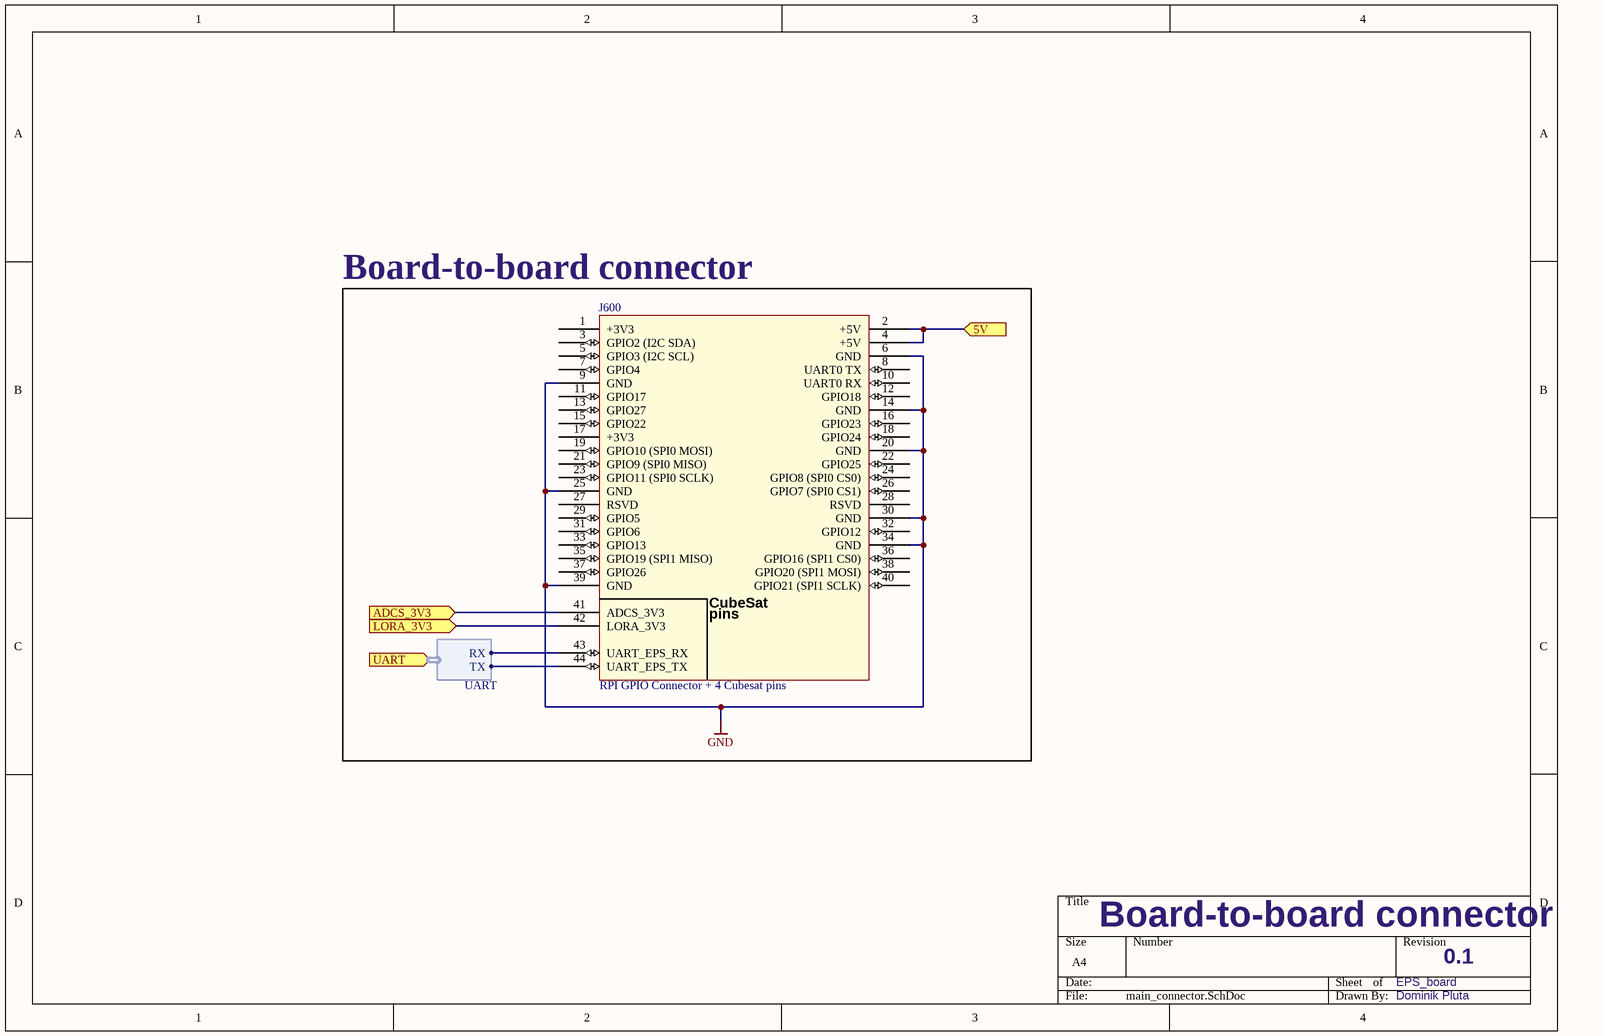
[diagram p5: main_connector.SchDoc]

### Parts
J600  RPI GPIO Connector + 4 Cubesat pins  [rpi]

### Blocks framed on the sheet
Board-to-board connector: J600

### Ports
5V (in, see EPS[4B]), ADCS_3V3 (in, see EPS[4B]), LORA_3V3 (in, see EPS[4B]), UART (in, harness UART, see EPS[4B], uC[4C])

### Harnesses
UART: RX, TX

### Nets
3,3V: J600.41(ADCS_3V3) J600.42(LORA_3V3) ; port ADCS_3V3, port LORA_3V3
5V: J600.2(+5V) J600.4(+5V) ; port 5V
GND: J600.6(GND) J600.9(GND) J600.14(GND) J600.20(GND) J600.25(GND) J600.30(GND) J600.34(GND) J600.39(GND)
RX: J600.43(UART_EPS_RX) ; port UART.RX
TX: J600.44(UART_EPS_TX) ; port UART.TX

Not connected (* = marked no-connect by the designer): J600 1(+3V3) 3(GPIO2_(I2C_SDA)) 5(GPIO3_(I2C_SCL)) 7(GPIO4) 8(UART0_TX) 10(UART0_RX) 11(GPIO17) 12(GPIO18) 13(GPIO27) 15(GPIO22) 16(GPIO23) 17(+3V3) 18(GPIO24) 19(GPIO10_(SPI0_MOSI)) 21(GPIO9_(SPI0_MISO)) 22(GPIO25) 23(GPIO11_(SPI0_SCLK)) 24(GPIO8_(SPI0_CS0)) 26(GPIO7_(SPI0_CS1)) 27(RSVD) 28(RSVD) 29(GPIO5) 31(GPIO6) 32(GPIO12) 33(GPIO13) 35(GPIO19_(SPI1_MISO)) 36(GPIO16_(SPI1_CS0)) 37(GPIO26) 38(GPIO20_(SPI1_MOSI)) 40(GPIO21_(SPI1_SCLK))

### Notes on the sheet
- Board-to-board connector
- EPS_board
- 0.1
- Dominik Pluta
- (in symbol rpi connector) CubeSat; pins

### Library data of the parts
J600 = rpi connector: GPIO Header for Raspberry Pi A+/B+/Pi 2/Pi 3 - 2x20 + 4 Cubesat pins; Manufacturer: SparkFun Electronics; Manufacturer Part Number: PRT-14017; Nils Minor: author; nilsminor@web.de: mail; RoHS: RoHS Compliant; Category: Development Boards, Kits, Programmers; Stock 1: 150; Pricing 1: 1=1.84 (EUR); Part Status: Active; Accessory Type: Connector; For Use With/Related Products: Raspberry Pi; ComponentLink1URL: https://cdn.sparkfun.com/datasheets/Dev/RaspberryPi/12313.pdf; ComponentLink1Description: https://cdn.sparkfun.com/datasheets/Dev/RaspberryPi/12313.pdf

## Sheet peripherals.SchDoc
size A4; SheetNumber: 7; SheetTotal: 7
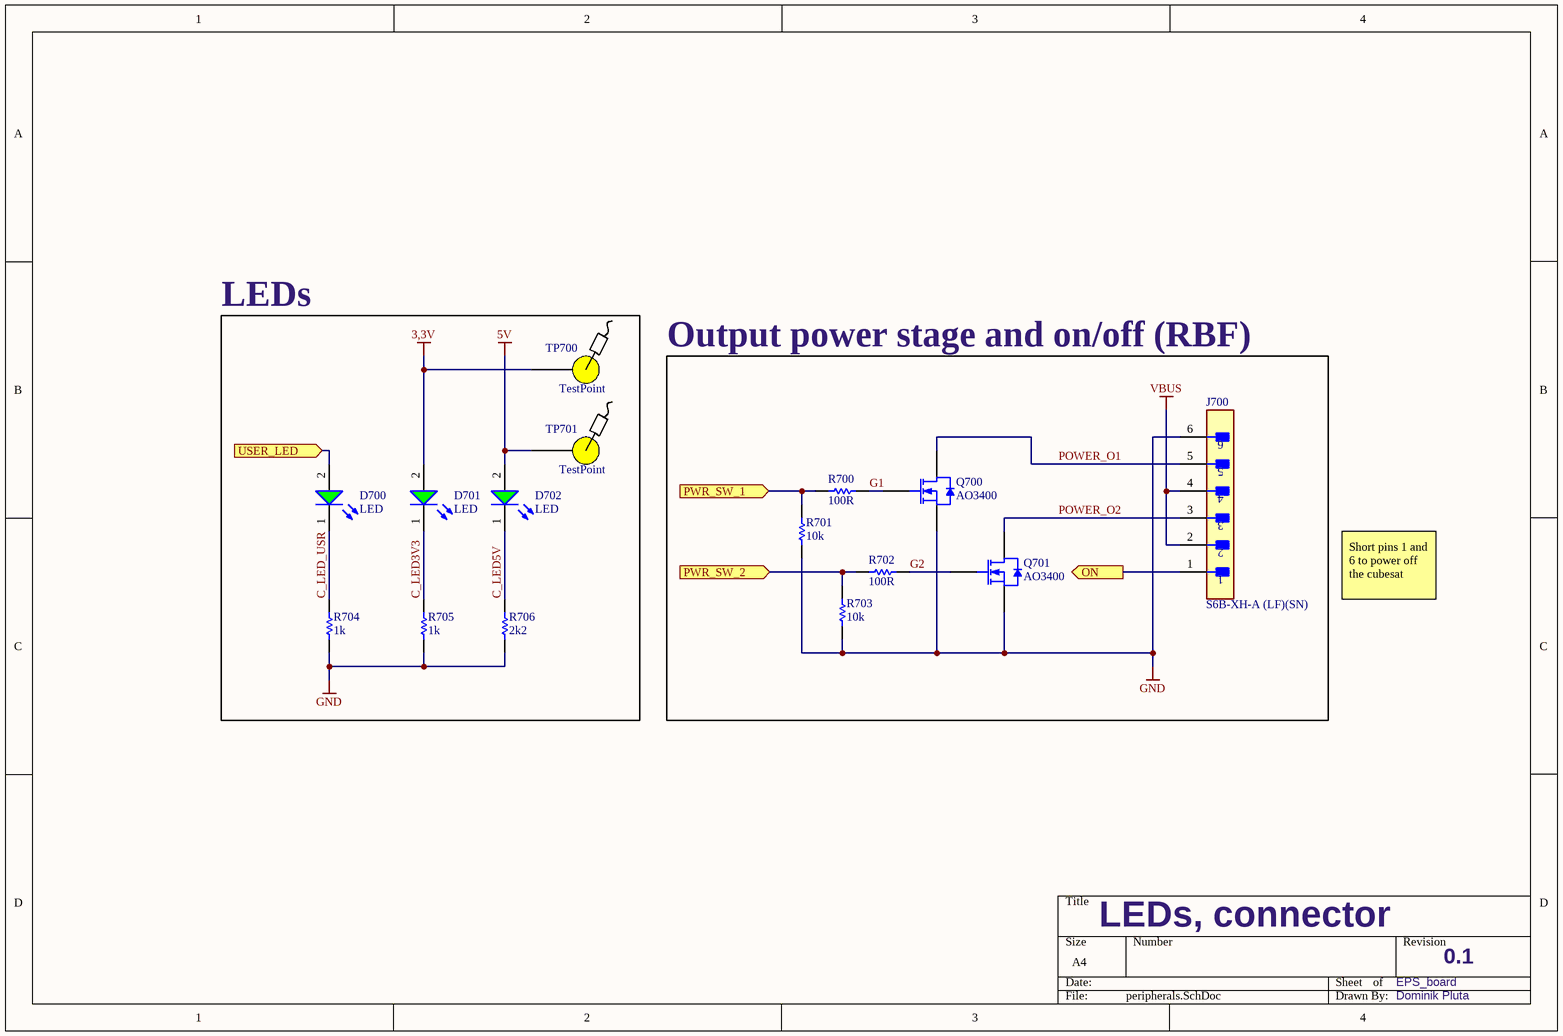
[diagram p6: peripherals.SchDoc]

### Parts
D700  LED  [WL-SMCW_0603_150060xx75000]
D701  LED  [WL-SMCW_0603_150060xx75000]
D702  LED  [WL-SMCW_0603_150060xx75000]
J700  S6B-XH-A (LF)(SN)  [FP-S6B-XH-A_LF_SN-MFG]
Q700  AO3400  [AO-SOT23-3_V]
Q701  AO3400  [AO-SOT23-3_V]
R700  100R  [RESC0603(1608)_N]
R701  10k  [RESC0603(1608)_N]
R702  100R  [RESC0603(1608)_N]
R703  10k  [RESC0603(1608)_N]
R704  1k  [RESC0603(1608)_N]
R705  1k  [RESC0603(1608)_N]
R706  2k2  [RESC0603(1608)_N]
TP700  TestPoint  [Test-point]  (no BOM)
TP701  TestPoint  [Test-point]  (no BOM)

### Blocks framed on the sheet
LEDs: D700-D702 R704-R706 TP700 TP701
Output power stage and on/off (RBF): J700 Q700 Q701 R700-R703

### Ports
ON (out, see EPS[4C]), PWR_SW_1 (in, see EPS[4C], uC[3C]), PWR_SW_2 (in, see EPS[4C], uC[3C]), USER_LED (in, see EPS[4C])

### Nets
3,3V: D701.2(A) TP700.1
5V: D702.2(A) TP701.1
GND: J700.6 Q700.2(S) Q701.2(S) R701.1 R703.1 R704.1 R705.1 R706.1
VBUS: J700.2 J700.4
C_LED3V3: D701.1(K) R705.2
C_LED5V: D702.1(K) R706.2
C_LED_USR: D700.1(K) R704.2
EN_5V_3V3: J700.1 ; port ON
G1: Q700.1(G) R700.1
G2: Q701.1(G) R702.1
POWER_O1: J700.5 Q700.3(D)
POWER_O2: J700.3 Q701.3(D)
POWER_sw1: R700.2 R701.2 ; port PWR_SW_1
POWER_sw2: R702.2 R703.2 ; port PWR_SW_2
USER_LED: D700.2(A) ; port USER_LED

### Notes on the sheet
- Short pins 1 and 6 to power off the cubesat
- LEDs, connector
- EPS_board
- 0.1
- Dominik Pluta

### Library data of the parts
D700 = CMP-1426-00006-6: Green LED; NexarPartId: 29717778; Reverse Voltage: 5V; Forward Voltage: 2V; Viewing Angle: 140°; Luminous Intensity: 40mcd; Test Current: 20mA; Max Junction Temperature (Tj): 95°C; Wavelength: 570nm; Forward Current: 100mA; Lens Style: Clear, Rectangular; Power Dissipation: 72mW; Peak Wavelength: 572nm; Packaging: Tape and Reel; REACH SVHC: Unknown; Width: 800µm; Max Operating Temperature: 85°C; Number of Pins: 2; RoHS: Compliant; Dominant Wavelength: 570nm; Min Operating Temperature: -40°C; Case Code (Imperial): 0603; Height: 700µm; Length: 1.6mm; Color: Green; Case Code (Metric): 1608; Case/Package: 0603; Max Reverse Voltage (DC): 5V; Mount: Surface Mount
D701 D702 = CMP-1426-00006-6: NexarPartId: 29717778; Reverse Voltage: 5V; Forward Voltage: 2V; Viewing Angle: 140°; Luminous Intensity: 40mcd; Test Current: 20mA; Max Junction Temperature (Tj): 95°C; Wavelength: 570nm; Forward Current: 100mA; Color: Green; Lens Style: Clear, Rectangular; Power Dissipation: 72mW; Peak Wavelength: 572nm; Packaging: Tape and Reel; REACH SVHC: Unknown; Width: 800µm; Max Operating Temperature: 85°C; Number of Pins: 2; RoHS: Compliant; Dominant Wavelength: 570nm; Min Operating Temperature: -40°C; Case Code (Imperial): 0603; Height: 700µm; Length: 1.6mm; Case Code (Metric): 1608; Case/Package: 0603; Max Reverse Voltage (DC): 5V; Mount: Surface Mount
J700 = CMP-17439-000165-2: CONN HEADER R/A 6POS 2.5MM; Number of Contacts: 6; Contact Resistance: 20mR; Max Current Rating: 3A; Max Voltage Rating (AC): 250V; Gender: Male; Insulation Resistance: 1GR; Wire/Cable Gauge: 22AWG; Fastening Type: Detent; Lead Pitch: 2.5mm; Flammability Rating: UL94 V-0; Contact Finish - Mating: TIN; Housing Material: Polyamide; Length: 17.4mm; Termination: Solder; Contact Type: Male Pin; Number of Positions: 6; Mount: Through Hole; Orientation: Right Angle; Voltage Rating (AC): 250V; Contact Shape: Square; Lead Free: Lead Free; Insulation Material: Nylon; Insulation Color: Natural; Contact Plating: Tin; Connector Type: Header; Housing Color: White; Color: Natural; Package Quantity: 500; Contact Material: Brass; Packaging: Bulk; Pitch: 2.5mm; Series: XH; Number of Rows: 1; Min Operating Temperature: -25°C; Voltage Rating: 250V; REACH SVHC: No SVHC; Current Rating: 3A; Depth: 11.5mm; Max Operating Temperature: 85°C
Q700 Q701 = CMP-0278-00001-1: N-channel Enhancement Mode Field-Effect Transistor; 5.8A/30V; Manufacturer: Alpha and Omega; Channel Type: N; Drain-Source Voltage Limit: 30 V; Junction Temperature: -55 to 150 degC; Gate-Source Voltage Limit: +/-12 V; PackageDescription: 3-Pin SOT23, 3.016 x 2.8 mm Body, 0.95 mm Pitch; ComponentLink2Description: Datasheet; DatasheetVersion: Rev.8, 12/2011; ComponentLink3URL: http://www.aosmd.com/res/packaging_information/SOT-23.pdf; Storage Temperature: -55 to 150 degC; ComponentLink3Description: Package Specification; PackageReference: SOT23; ComponentLink1Description: Manufacturer URL; Mounting Technology: Surface Mount; ComponentLink1URL: http://www.aosmd.com/; PartNumber: AO3400; ComponentLink2URL: http://www.aosmd.com/res/data_sheets/AO3400.pdf
R700 R702 = CMP-1012-00081-1: 100R 0.1W 5% 0603 SMD; Case-Metric: 1608; Value: 100.00 Ohm; Case-EIA: 0603; Tolerance: 5 %; Technology: SMT; Power: 0.1 W
R701 R703 = CMP-1012-00081-1: 10k 0.1W 5% 0603 SMD; Case-Metric: 1608; Value: 2000.00 Ohm; Case-EIA: 0603; Tolerance: 5 %; Technology: SMT; Power: 0.1 W
R704 = CMP-1012-00081-1: 1K 0.1W 5% 0603 SMD; Case-Metric: 1608; Value: 1000.00 Ohm; Case-EIA: 0603; Tolerance: 5 %; Technology: SMT; Power: 0.1 W
R705 = CMP-1012-00081-1: 1k 0.1W 5% 0603 (1608 Metric)  SMD; Case-Metric: 1608; Value: 1000.00 Ohm; Case-EIA: 0603; Tolerance: 5 %; Technology: SMT; Power: 0.1 W
R706 = CMP-1012-00081-1: 2k2 0.1W 5% 0603 SMD; Case-Metric: 1608; Value: 2200.00 Ohm; Case-EIA: 0603; Tolerance: 5 %; Technology: SMT; Power: 0.1 W
TP700 TP701 = Test-point: SMD test point

## Nets that join several sheets
3,3V: uC (15 pins), buck_boost (6 pins), main_connector (J600.41 J600.42), peripherals (D701.2 TP700.1)
5V: buck_boost (6 pins), main_connector (J600.2 J600.4), peripherals (D702.2 TP701.1)
GND: uC (33 pins), MPPT_charger1 (16 pins), MPPT_charger2 (16 pins), buck_boost (9 pins), buck_boost (9 pins), ideal_diode1 (C400A.2 C401A.1 U400A.2 U400A.3), ideal_diode2 (C400B.2 C401B.1 U400B.2 U400B.3), main_connector (8 pins), peripherals (8 pins)
VBUS: buck_boost (C500A.1 C501A.1 U500A.10 U500A.11), buck_boost (C500B.1 C501B.1 U500B.10 U500B.11), ideal_diode1 (C401A.2 Q400A.1 U400A.6), ideal_diode2 (C401B.2 Q400B.1 U400B.6), peripherals (J700.2 J700.4)
EN_5V_3V3: buck_boost (R502A.2 U500A.12), buck_boost (R502B.2 U500B.12), peripherals (J700.1)
IMON1: uC (U200.9), MPPT_charger1 (U300A.23)
IMON2: uC (U200.10), MPPT_charger2 (U300B.23)
MODE_3V3: uC (U200.25), buck_boost (R500B.2 U500B.13)
MODE_5V: uC (U200.28), buck_boost (R500A.2 U500A.13)
PG: uC (U200.58), MPPT_charger1 (U300A.19)
PG: uC (U200.59), MPPT_charger2 (U300B.19)
PG_3V3: uC (U200.24), buck_boost (U500B.14)
PG_5V: uC (U200.27), buck_boost (U500A.14)
POWER_sw1: uC (U200.35), peripherals (R700.2 R701.2)
POWER_sw2: uC (U200.34), peripherals (R702.2 R703.2)
RX: uC (U200.30), main_connector (J600.43)
SYNC_CHRGR: uC (U200.11), MPPT_charger1 (R302A.1 U300A.1), MPPT_charger2 (R302B.1 U300B.1)
TX: uC (U200.29), main_connector (J600.44)
USER_LED: uC (U200.54), peripherals (D700.2)
VBAT1: uC (R200.2), MPPT_charger1 (10 pins), ideal_diode1 (C400A.1 Q400A.3 U400A.1)
VBAT2: uC (R201.2), MPPT_charger2 (10 pins), ideal_diode2 (C400B.1 Q400B.3 U400B.1)